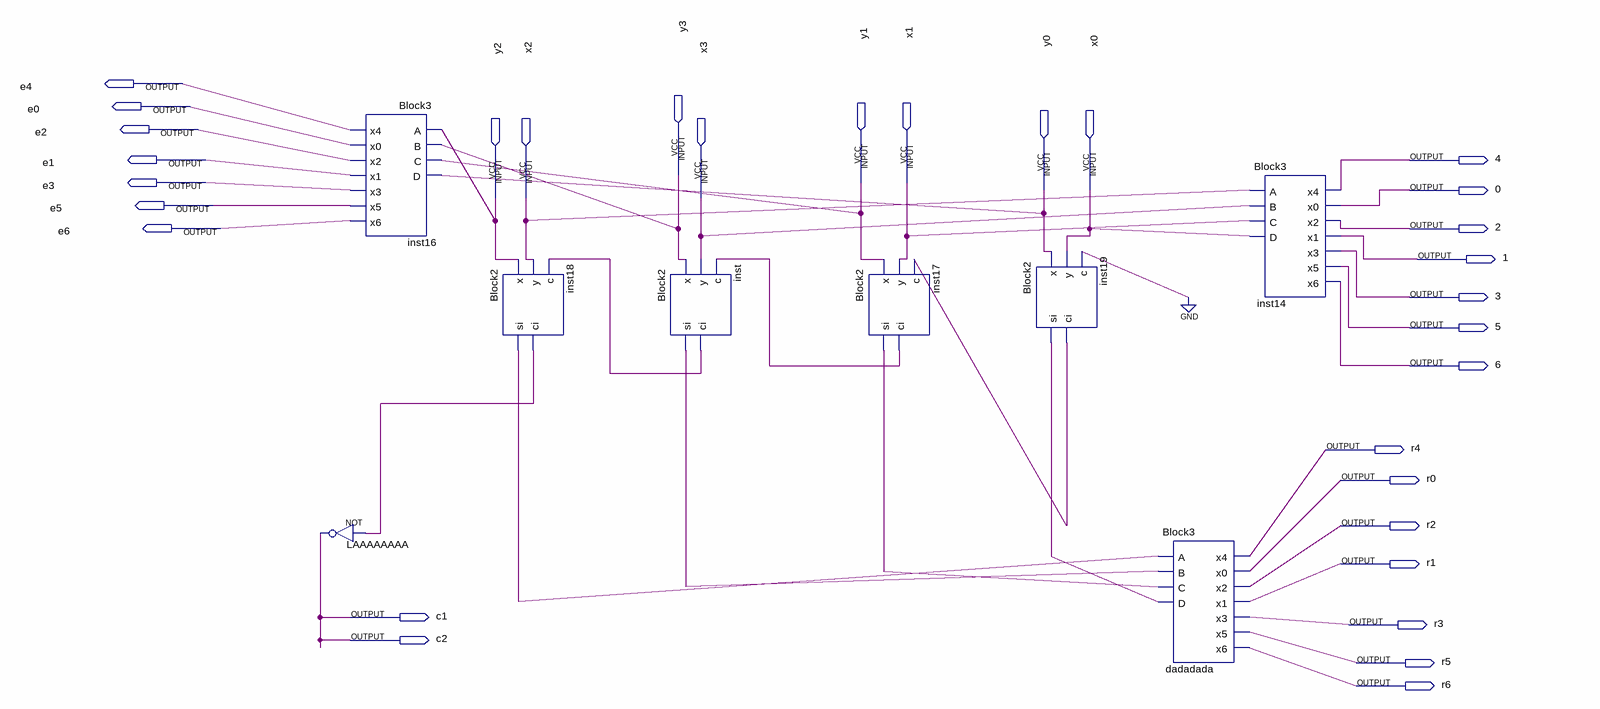
[diagram p0: schematic sheet]
// Quartus schematic Block1.bdf as structural Verilog: 8 symbols, 31 pins
module Block1 (
  input  y3,
  input  y1,
  input  x1,
  input  y0,
  input  x0,
  input  y2,
  input  x2,
  input  x3,
  output e4,
  output e0,
  output e2,
  output e1,
  output \4 ,
  output e3,
  output \0 ,
  output e5,
  output e6,
  output \2 ,
  output \1 ,
  output \3 ,
  output \5 ,
  output \6 ,
  output r4,
  output r0,
  output r2,
  output r1,
  output c1,
  output r3,
  output c2,
  output r5,
  output r6
);

  wire inst17_ci, inst17_si, inst18_ci, inst18_si, inst19_ci, inst19_si, inst_ci, inst_si;

  not LAAAAAAAA (c1, inst18_ci);
  Block3 inst16 (.A(y2), .B(y3), .C(y1), .D(y0), .x4(e4), .x0(e0), .x2(e2), .x1(e1), .x3(e3), .x5(e5), .x6(e6));
  Block2 inst18 (.x(y2), .y(x2), .c(inst_ci), .si(inst18_si), .ci(inst18_ci));
  Block2 inst (.x(y3), .y(x3), .c(inst17_ci), .si(inst_si), .ci(inst_ci));
  Block2 inst17 (.x(y1), .y(x1), .c(inst19_ci), .si(inst17_si), .ci(inst17_ci));
  Block2 inst19 (.x(y0), .y(x0), .c(1'b0), .si(inst19_si), .ci(inst19_ci));
  Block3 dadadada (
    .A(inst18_si), .B(inst_si), .C(inst17_si), .D(inst19_si), .x4(r4), .x0(r0), .x2(r2), .x1(r1), .x3(r3),
    .x5(r5), .x6(r6));
  Block3 inst14 (.A(x2), .B(x3), .C(x1), .D(x0), .x4(\4 ), .x0(\0 ), .x2(\2 ), .x1(\1 ), .x3(\3 ), .x5(\5 ), .x6(\6 ));

  assign c2 = c1;
endmodule
